# Altium schematic sheet 03-ADC.schdoc
size 307 x 218 mm; Symbol: muban; Device: muban; @Project Name: 12345678; @Create Date: 2025-07-10; @Schematic Name: Mini Oscilloscope; @Page Count: 5; @Update Date: 2025-07-12; @Update Time: 08:23:10; @Page Name: 03-ADC; @Page No: 3; @Create Time: 07:23:56; @Board Name: Base Board; Title Block Position: 3; Width: 1170; Height: 825; Region Start: 1; X Region Count: 6; Y Region Count: 4; Blade Width: 10; Description: 模拟题模板
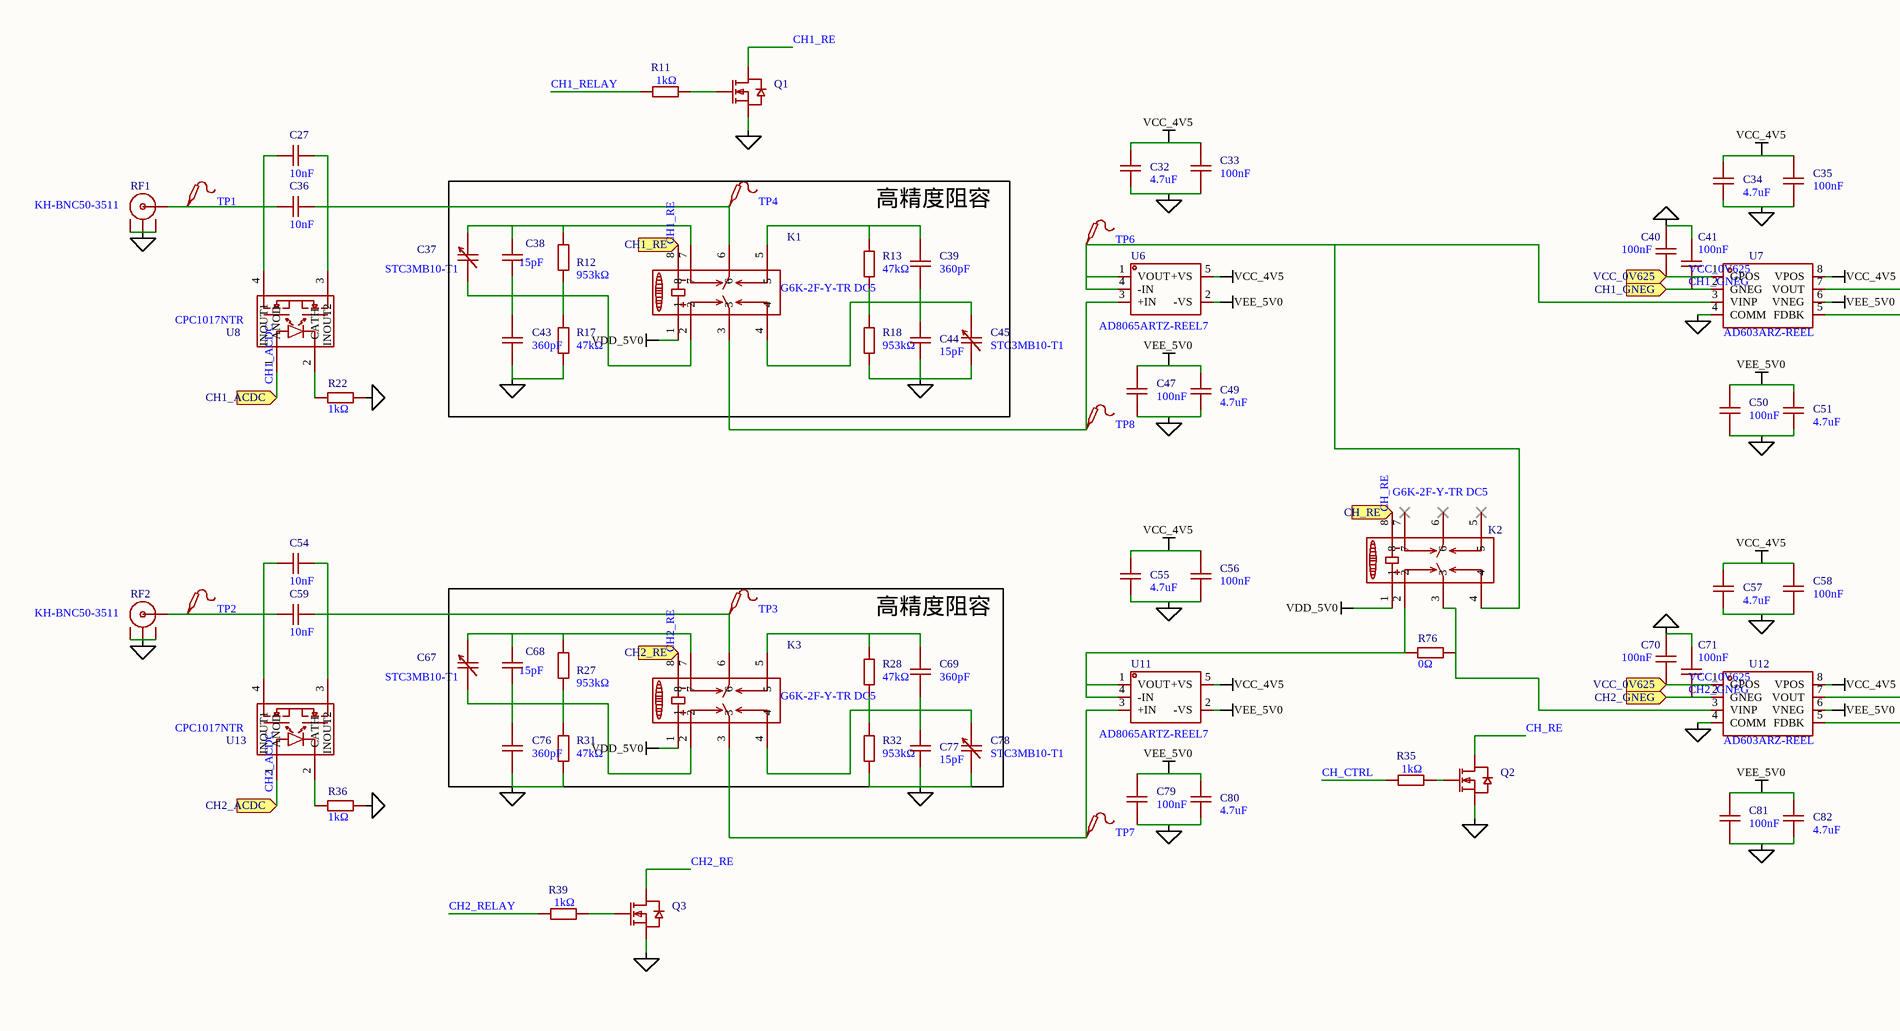
[diagram p0: 03-ADC.schdoc, left]
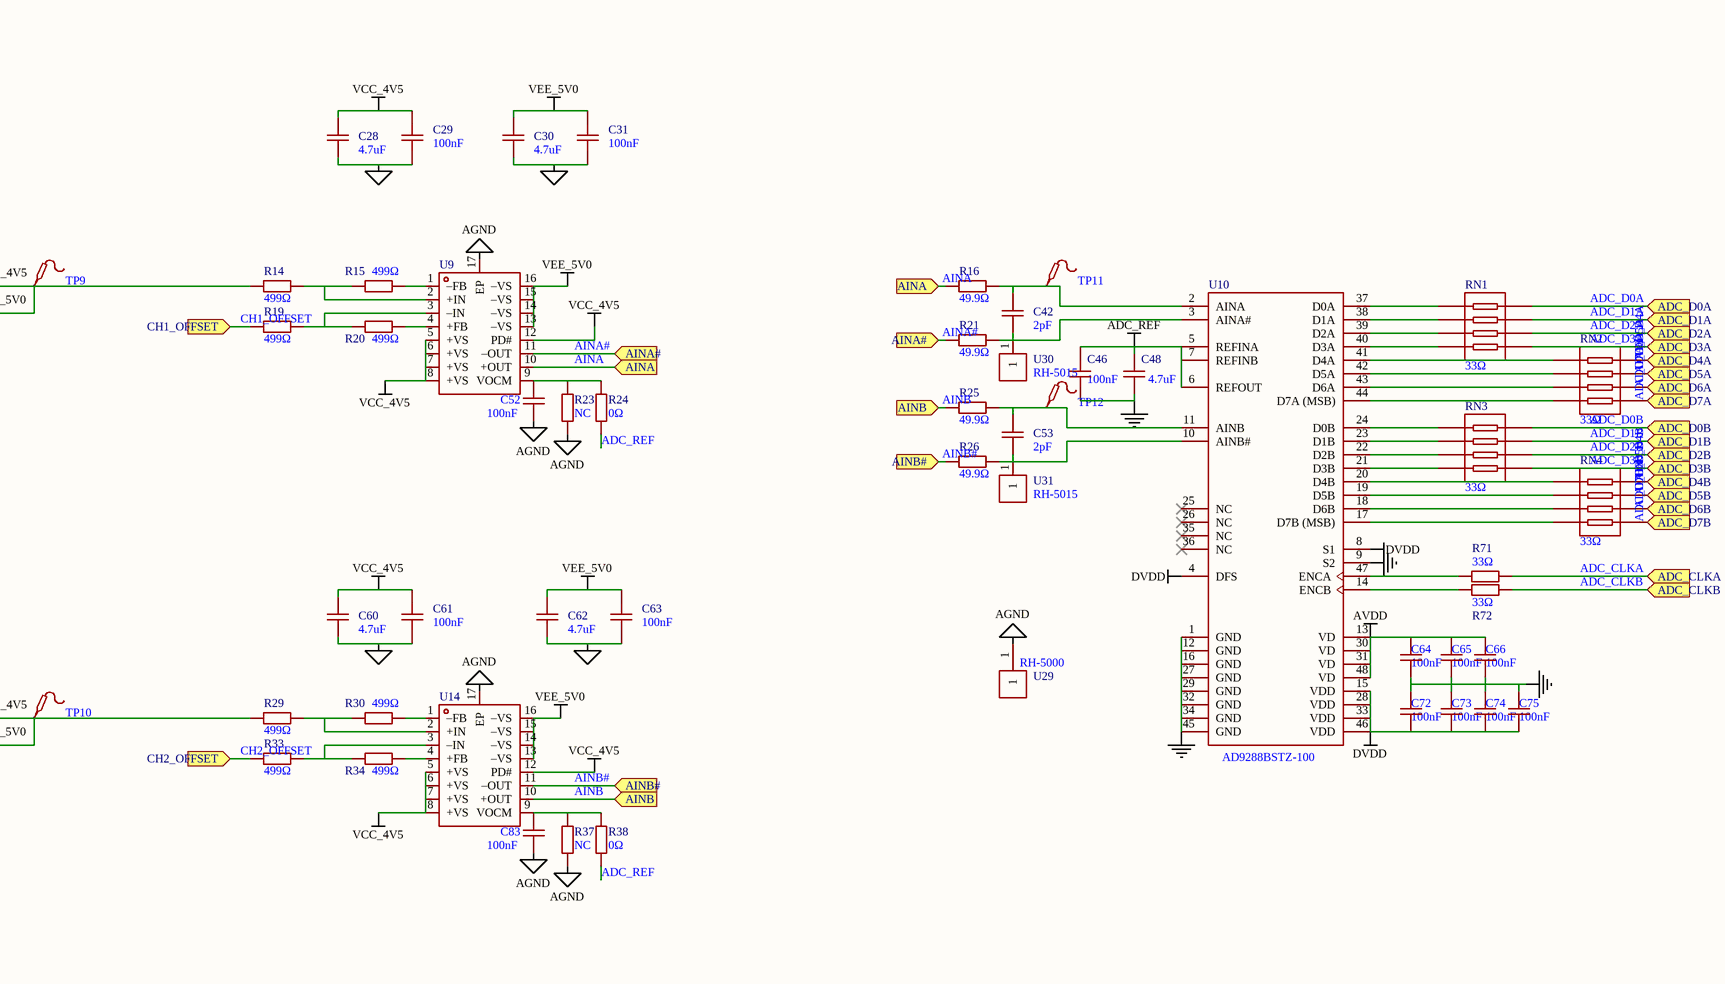
[diagram p1: 03-ADC.schdoc, right]

## Parts
C27  10nF  [C0603]
C28  4.7uF  [C0603]
C29  100nF  [C0603]
C30  4.7uF  [C0603]
C31  100nF  [C0603]
C32  4.7uF  [C0603]
C33  100nF  [C0603]
C34  4.7uF  [C0603]
C35  100nF  [C0603]
C36  10nF  [C0603]
C37  STC3MB10-T1  [CAP-SMD_L4.5-W3.2_STC3MD20-T1]
C38  15pF  [C0603]
C39  360pF  [C0603]
C40  100nF  [C0603]
C41  100nF  [C0603]
C42  2pF  [C0603]
C43  360pF  [C0603]
C44  15pF  [C0603]
C45  STC3MB10-T1  [CAP-SMD_L4.5-W3.2_STC3MD20-T1]
C46  100nF  [C0603]
C47  100nF  [C0603]
C48  4.7uF  [C0603]
C49  4.7uF  [C0603]
C50  100nF  [C0603]
C51  4.7uF  [C0603]
C52  100nF  [C0603]
C53  2pF  [C0603]
C54  10nF  [C0603]
C55  4.7uF  [C0603]
C56  100nF  [C0603]
C57  4.7uF  [C0603]
C58  100nF  [C0603]
C59  10nF  [C0603]
C60  4.7uF  [C0603]
C61  100nF  [C0603]
C62  4.7uF  [C0603]
C63  100nF  [C0603]
C64  100nF  [C0603]
C65  100nF  [C0603]
C66  100nF  [C0603]
C67  STC3MB10-T1  [CAP-SMD_L4.5-W3.2_STC3MD20-T1]
C68  15pF  [C0603]
C69  360pF  [C0603]
C70  100nF  [C0603]
C71  100nF  [C0603]
C72  100nF  [C0603]
C73  100nF  [C0603]
C74  100nF  [C0603]
C75  100nF  [C0603]
C76  360pF  [C0603]
C77  15pF  [C0603]
C78  STC3MB10-T1  [CAP-SMD_L4.5-W3.2_STC3MD20-T1]
C79  100nF  [C0603]
C80  4.7uF  [C0603]
C81  100nF  [C0603]
C82  4.7uF  [C0603]
C83  100nF  [C0603]
K1  G6K-2F-Y-TR DC5  [RELAY-SMD_G6K-2F-X-XX]
K2  G6K-2F-Y-TR DC5  [RELAY-SMD_G6K-2F-X-XX]
K3  G6K-2F-Y-TR DC5  [RELAY-SMD_G6K-2F-X-XX]
Q1  (no value)  [sot-23-3_l2.9-w1.3-p1.90-ls2.4-br]
Q2  (no value)  [sot-23-3_l2.9-w1.3-p1.90-ls2.4-br]
Q3  (no value)  [sot-23-3_l2.9-w1.3-p1.90-ls2.4-br]
R11  1kΩ  [R0603]
R12  953kΩ  [R0603]
R13  47kΩ  [R0603]
R14  499Ω  [R0603]
R15  499Ω  [R0603]
R16  49.9Ω  [R0603]
R17  47kΩ  [R0603]
R18  953kΩ  [R0603]
R19  499Ω  [R0603]
R20  499Ω  [R0603]
R21  49.9Ω  [R0603]
R22  1kΩ  [R0603]
R23  NC  [R0603]
R24  0Ω  [R0603]
R25  49.9Ω  [R0603]
R26  49.9Ω  [R0603]
R27  953kΩ  [R0603]
R28  47kΩ  [R0603]
R29  499Ω  [R0603]
R30  499Ω  [R0603]
R31  47kΩ  [R0603]
R32  953kΩ  [R0603]
R33  499Ω  [R0603]
R34  499Ω  [R0603]
R35  1kΩ  [R0603]
R36  1kΩ  [R0603]
R37  NC  [R0603]
R38  0Ω  [R0603]
R39  1kΩ  [R0603]
R71  33Ω  [R0603]
R72  33Ω  [R0603]
R76  0Ω  [R0603]
RF1  KH-BNC50-3511  [ANT-TH_KH-BNC50-3511]
RF2  KH-BNC50-3511  [ANT-TH_KH-BNC50-3511]
RN1  33Ω  [RES-ARRAY-SMD_0603-8P-L3.2-W1.6-BL]
RN2  33Ω  [RES-ARRAY-SMD_0603-8P-L3.2-W1.6-BL]
RN3  33Ω  [RES-ARRAY-SMD_0603-8P-L3.2-W1.6-BL]
RN4  33Ω  [RES-ARRAY-SMD_0603-8P-L3.2-W1.6-BL]
TP1  (no value)  [Test-Point-0.5mm]
TP2  (no value)  [Test-Point-0.5mm]
TP3  (no value)  [Test-Point-0.5mm]
TP4  (no value)  [Test-Point-0.5mm]
TP6  (no value)  [Test-Point-0.5mm]
TP7  (no value)  [Test-Point-0.5mm]
TP8  (no value)  [Test-Point-0.5mm]
TP9  (no value)  [Test-Point-0.5mm]
TP10  (no value)  [Test-Point-0.5mm]
TP11  (no value)  [Test-Point-0.5mm]
TP12  (no value)  [Test-Point-0.5mm]
U6  AD8065ARTZ-REEL7  [SOT-23-5_L3.0-W1.7-P0.95-LS2.8-BL]
U7  AD603ARZ-REEL  [SOIC-8_L4.9-W3.9-P1.27-LS6.0-BL]
U8  CPC1017NTR  [SOP-4_L4.1-W3.8-P2.54-LS6.1-BL]
U9  ADA4932-1YCPZ-R7  [LFCSP-16_L3.0-W3.0-P0.50-TL-EP]  (value not drawn)
U10  AD9288BSTZ-100  [LQFP-48_L7.0-W7.0-P0.50-LS9.0-BL]
U11  AD8065ARTZ-REEL7  [SOT-23-5_L3.0-W1.7-P0.95-LS2.8-BL]
U12  AD603ARZ-REEL  [SOIC-8_L4.9-W3.9-P1.27-LS6.0-BL]
U13  CPC1017NTR  [SOP-4_L4.1-W3.8-P2.54-LS6.1-BL]
U14  ADA4932-1YCPZ-R7  [LFCSP-16_L3.0-W3.0-P0.50-TL-EP]  (value not drawn)
U29  RH-5000  [TEST-TH_BD2.54-P1.4_RED]
U30  RH-5015  [SMD_RH-5015]
U31  RH-5015  [SMD_RH-5015]

## Blocks framed on the sheet
高精度阻容: C37-C39 C43-C45 K1 R12 R13 R17 R18 TP4
高精度阻容: C67-C69 C76-C78 K3 R27 R28 R31 R32 TP3

## Ports
ADC_CLKA (in), ADC_CLKB (in), ADC_D0A (in), ADC_D0B (in), ADC_D1A (in), ADC_D1B (in), ADC_D2A (in), ADC_D2B (in), ADC_D3A (in), ADC_D3B (in), ADC_D4A (in), ADC_D4B (in), ADC_D5A (in), ADC_D5B (in), ADC_D6A (in), ADC_D6B (in), ADC_D7A (in), ADC_D7B (in), AINA (in), AINA# (in), AINB (in), AINB# (in), CH1_ACDC (in), CH1_GNEG (in), CH1_OFFSET (in), CH1_RE (in), CH2_ACDC (in), CH2_GNEG (in), CH2_OFFSET (in), CH2_RE (in), CH_RE (in), VCC_0V625 (in)

## Nets
ADC_REF: C46.2 C48.2 R24.1 R38.1 U10.5(REFINA) U10.6(REFOUT) U10.7(REFINB)
AGND: C28.1 C29.1 C30.1 C31.1 C32.1 C33.1 C34.1 C35.1 C40.1 C41.2 C43.1 C44.2 C45.1 C47.1 C49.1 C50.1 C51.1 C52.1 C55.1 C56.1 C57.1 C58.1 C60.1 C61.1 C62.1 C63.1 C70.1 C71.2 C76.1 C77.2 C78.1 C79.1 C80.1 C81.1 C82.1 C83.1 Q1.2(S) Q2.2(S) Q3.2(S) R17.1 R18.2 R22.1 R23.1 R31.1 R32.2 R36.1 R37.1 RF1.2 RF1.3 RF1.4 RF2.2 RF2.3 RF2.4 U7.4(COMM) U9.17(EP) U12.4(COMM) U14.17(EP) U29.1
AVDD: C64.1 C65.1 C66.1 U10.13(VD) U10.30(VD) U10.31(VD) U10.48(VD)
DVDD: C72.2 C73.2 C74.2 C75.2 U10.4(DFS) U10.8(S1) U10.15(VDD) U10.28(VDD) U10.33(VDD) U10.46(VDD)
GND: C46.1 C48.1 C64.2 C65.2 C66.2 C72.1 C73.1 C74.1 C75.1 U10.1(GND) U10.9(S2) U10.12(GND) U10.16(GND) U10.27(GND) U10.29(GND) U10.32(GND) U10.34(GND) U10.45(GND)
VCC_4V5: C28.2 C29.2 C32.2 C33.2 C34.2 C35.2 C55.2 C56.2 C57.2 C58.2 C60.2 C61.2 U6.5(+VS) U7.8(VPOS) U9.5(+VS) U9.6(+VS) U9.7(+VS) U9.8(+VS) U9.12(PD#) U11.5(+VS) U12.8(VPOS) U14.5(+VS) U14.6(+VS) U14.7(+VS) U14.8(+VS) U14.12(PD#)
VDD_5V0: K1.1 K2.1 K3.1
VEE_5V0: C30.2 C31.2 C47.2 C49.2 C50.2 C51.2 C62.2 C63.2 C79.2 C80.2 C81.2 C82.2 U6.2(-VS) U7.6(VNEG) U9.13(–VS) U9.14(–VS) U9.15(–VS) U9.16(–VS) U11.2(-VS) U12.6(VNEG) U14.13(–VS) U14.14(–VS) U14.15(–VS) U14.16(–VS)
ADC_CLKA: R71.2 ; port ADC_CLKA
ADC_CLKB: R72.2 ; port ADC_CLKB
ADC_D0A: RN1.8 ; port ADC_D0A
ADC_D0B: RN3.8 ; port ADC_D0B
ADC_D1A: RN1.7 ; port ADC_D1A
ADC_D1B: RN3.7 ; port ADC_D1B
ADC_D2A: RN1.6 ; port ADC_D2A
ADC_D2B: RN3.6 ; port ADC_D2B
ADC_D3A: RN1.5 ; port ADC_D3A
ADC_D3B: RN3.5 ; port ADC_D3B
ADC_D4A: RN2.8 ; port ADC_D4A
ADC_D4B: RN4.8 ; port ADC_D4B
ADC_D5A: RN2.7 ; port ADC_D5A
ADC_D5B: RN4.7 ; port ADC_D5B
ADC_D6A: RN2.6 ; port ADC_D6A
ADC_D6B: RN4.6 ; port ADC_D6B
ADC_D7A: RN2.5 ; port ADC_D7A
ADC_D7B: RN4.5 ; port ADC_D7B
AINA: R16.1 U9.10(+OUT) ; port AINA
AINA#: R21.1 U9.11(–OUT) ; port AINA#
AINB: R25.1 U14.10(+OUT) ; port AINB
AINB#: R26.1 U14.11(–OUT) ; port AINB#
CH1_ACDC: U8.1(ANOD) ; port CH1_ACDC
CH1_GNEG: C41.1 U7.2(GNEG) ; port CH1_GNEG
CH1_OFFSET: R19.1 ; port CH1_OFFSET
CH1_RE: K1.8 Q1.3(D) ; port CH1_RE
CH1_RELAY: R11.2
CH2_ACDC: U13.1(ANOD) ; port CH2_ACDC
CH2_GNEG: C71.1 U12.2(GNEG) ; port CH2_GNEG
CH2_OFFSET: R33.1 ; port CH2_OFFSET
CH2_RE: K3.8 Q3.3(D) ; port CH2_RE
CH2_RELAY: R39.2
CH_CTRL: R35.2
CH_RE: K2.8 Q2.3(D) ; port CH_RE
VCC_0V625: C40.2 C70.2 U7.1(GPOS) U12.1(GPOS) ; port VCC_0V625
NetC27_1: C27.1 C36.1 RF1.1(OUT) TP1.1 U8.4(INOUT1)
NetC27_2: C27.2 C36.2 K1.6 TP4.1 U8.3(INOUT2)
NetC37_1: C37.1 C38.1 C43.2 K1.2 R12.1 R17.2
NetC37_2: C37.2 C38.2 K1.7 R12.2
NetC39_1: C39.1 K1.5 R13.1
NetC39_2: C39.2 C44.1 C45.2 K1.4 R13.2 R18.1
NetC42_1: C42.1 R21.2 U10.3(AINA#) U30.1
NetC42_2: C42.2 R16.2 TP11.1 U10.2(AINA)
NetC52_2: C52.2 R23.2 R24.2 U9.9(VOCM)
NetC53_1: C53.1 R26.2 U10.10(AINB#) U31.1
NetC53_2: C53.2 R25.2 TP12.1 U10.11(AINB)
NetC54_1: C54.1 C59.1 RF2.1(OUT) TP2.1 U13.4(INOUT1)
NetC54_2: C54.2 C59.2 K3.6 TP3.1 U13.3(INOUT2)
NetC67_1: C67.1 C68.1 C76.2 K3.2 R27.1 R31.2
NetC67_2: C67.2 C68.2 K3.7 R27.2
NetC69_1: C69.1 K3.5 R28.1
NetC69_2: C69.2 C77.1 C78.2 K3.4 R28.2 R32.1
NetC83_2: C83.2 R37.2 R38.2 U14.9(VOCM)
NetK1_3: K1.3 TP8.1 U6.3(+IN)
NetK2_2: K2.2 R76.1 U11.1(VOUT) U11.4(-IN)
NetK2_3: K2.3 R76.2 U12.3(VINP)
NetK2_4: K2.4 TP6.1 U6.1(VOUT) U6.4(-IN) U7.3(VINP)
NetK3_3: K3.3 TP7.1 U11.3(+IN)
NetQ1_1: Q1.1(G) R11.1
NetQ2_1: Q2.1(G) R35.1
NetQ3_1: Q3.1(G) R39.1
NetR14_1: R14.1 TP9.1 U7.5(FDBK) U7.7(VOUT)
NetR14_2: R14.2 R15.1 U9.2(+IN)
NetR15_2: R15.2 U9.1(–FB)
NetR19_2: R19.2 R20.1 U9.3(–IN)
NetR20_2: R20.2 U9.4(+FB)
NetR22_2: R22.2 U8.2(CATH)
NetR29_1: R29.1 TP10.1 U12.5(FDBK) U12.7(VOUT)
NetR29_2: R29.2 R30.1 U14.2(+IN)
NetR30_2: R30.2 U14.1(–FB)
NetR33_2: R33.2 R34.1 U14.3(–IN)
NetR34_2: R34.2 U14.4(+FB)
NetR36_2: R36.2 U13.2(CATH)
NetR71_1: R71.1 U10.47(ENCA)
NetR72_1: R72.1 U10.14(ENCB)
NetRN1_1: RN1.1 U10.37(D0A)
NetRN1_2: RN1.2 U10.38(D1A)
NetRN1_3: RN1.3 U10.39(D2A)
NetRN1_4: RN1.4 U10.40(D3A)
NetRN2_1: RN2.1 U10.41(D4A)
NetRN2_2: RN2.2 U10.42(D5A)
NetRN2_3: RN2.3 U10.43(D6A)
NetRN2_4: RN2.4 U10.44(D7A_(MSB))
NetRN3_1: RN3.1 U10.24(D0B)
NetRN3_2: RN3.2 U10.23(D1B)
NetRN3_3: RN3.3 U10.22(D2B)
NetRN3_4: RN3.4 U10.21(D3B)
NetRN4_1: RN4.1 U10.20(D4B)
NetRN4_2: RN4.2 U10.19(D5B)
NetRN4_3: RN4.3 U10.18(D6B)
NetRN4_4: RN4.4 U10.17(D7B_(MSB))

Not connected (* = marked no-connect by the designer): K2 5* 6* 7*; U10 25(NC)* 26(NC)* 35(NC)* 36(NC)*

## Notes on the sheet
- 1
- 2
- 3
- 4
- 5
- 6
- A
- B
- C
- D

## Library data of the parts
C27 C36 C54 C59 = CC0603KRX7R9BB103: Manufacturer: YAGEO(国巨); Symbol: CC0603KRX7R0BB103; Add into BOM: yes; Tolerance: ±10%; Voltage Rated: 50V; Temperature Coefficient: X7R; Device: CC0603KRX7R9BB103; LCSC Part Name: 10nF ±10% 50V; Supplier Part: C100042; Manufacturer Part: CC0603KRX7R9BB103; Supplier Footprint: 0603; JLCPCB Part Class: Extended Part; Datasheet: https://atta.szlcsc.com/upload/public/pdf/source/20181008/C309510_22F155564471FAF6A489F7D68F34234E.pdf; Supplier: LCSC; Convert to PCB: yes; Value: 10nF
C28 C30 C32 C34 C48 C49 C51 C55 C57 C60 C62 C80 C82 = CL10A475KO8NNNC: Manufacturer: SAMSUNG(三星); Add into BOM: yes; Tolerance: ±10%; Voltage Rated: 16V; Temperature Coefficient: X5R; Symbol: CL10A475KO8NNNC; Device: CL10A475KO8NNNC; LCSC Part Name: 4.7uF ±10% 16V; Supplier Part: C19666; Manufacturer Part: CL10A475KO8NNNC; Supplier Footprint: 0603; JLCPCB Part Class: Basic Part; Datasheet: https://atta.szlcsc.com/upload/public/pdf/source/20160218/1457707763339.pdf; Supplier: LCSC; Convert to PCB: yes; Value: 4.7uF
C29 C31 C33 C35 C40 C41 C46 C47 C50 C56 C58 C61 C63 C70 C71 C79 C81 = CGA0603X7R104K500JT: Manufacturer: HRE(芯声); Symbol: CC0603KRX7R9BB104; Add into BOM: yes; Tolerance: ±10%; Voltage Rated: 50V; Temperature Coefficient: X7R; Device: CGA0603X7R104K500JT; LCSC Part Name: 100nF ±10% 50V; Supplier Part: C6119867; Manufacturer Part: CGA0603X7R104K500JT; Supplier Footprint: 0603; JLCPCB Part Class: Extended Part; Datasheet: https://atta.szlcsc.com/upload/public/pdf/source/20250103/C44077DA9E7B3EFAE02F22B6D3D1CBC9.pdf; Supplier: LCSC; Convert to PCB: yes; Value: 100nF; Voltage Rating: 50V
C37 C45 C67 C78 = STC3MB10-T1: Manufacturer: SEHWA(韩国世华); Add into BOM: yes; electrostatic capacity: 3pF~10pF; Tolerance: 0%~+50%; Rated Voltage: 100V; Q @ Freq: 600@1MHz; Body Length: 4.5mm; Body Width: 3.2mm; Body Height: 1.5mm; Symbol: STC3MB10-T1; Device: STC3MB10-T1; LCSC Part Name: 3pF~10pF 100V; Supplier Part: C22468121; Manufacturer Part: STC3MB10-T1; Supplier Footprint: SMD,4.5x3.2mm; JLCPCB Part Class: 扩展库; Datasheet: https://atta.szlcsc.com/upload/public/pdf/source/20240625/3635C187CDEBB153FE63594366C5F0CE.pdf; Supplier: LCSC; Convert to PCB: yes; Operating Temperature: -25℃~+85℃
C38 C44 C68 C77 = CL10C150JB8NNNC: Manufacturer: SAMSUNG(三星); Add into BOM: yes; Tolerance: ±5%; Voltage Rated: 50V; Temperature Coefficient: C0G; Symbol: CL10C150JB8NNNC; Device: CL10C150JB8NNNC; LCSC Part Name: 15pF ±5% 50V; Supplier Part: C1644; Manufacturer Part: CL10C150JB8NNNC; Supplier Footprint: 0603; JLCPCB Part Class: Basic Part; Datasheet: https://atta.szlcsc.com/upload/public/pdf/source/20160218/1457707763339.pdf; Supplier: LCSC; Convert to PCB: yes; Value: 15pF
C39 C43 C69 C76 = CC0603JRNPO9BN361: Manufacturer: YAGEO(国巨); Add into BOM: yes; Tolerance: ±5%; Voltage Rated: 50V; Temperature Coefficient: NP0; Symbol: CC0603JRNPO9BN361; Device: CC0603JRNPO9BN361; LCSC Part Name: 360pF ±5% 50V; Supplier Part: C513587; Manufacturer Part: CC0603JRNPO9BN361; Supplier Footprint: 0603; JLCPCB Part Class: 扩展库; Datasheet: https://atta.szlcsc.com/upload/public/pdf/source/20200720/C513587_5034A81EC915B34B5783BA1E5C90B9FE.pdf; Supplier: LCSC; Convert to PCB: yes; Value: 360pF
C42 C53 = 0603CG2R0C500NT: Manufacturer: FH(风华); Add into BOM: yes; Voltage Rated: 50V; Temperature Coefficient: C0G; Symbol: 0603CG2R0C500NT; Device: 0603CG2R0C500NT; LCSC Part Name: 2pF 50V; Supplier Part: C1650; Manufacturer Part: 0603CG2R0C500NT; Supplier Footprint: 0603; JLCPCB Part Class: 扩展库; Datasheet: https://atta.szlcsc.com/upload/public/pdf/source/20200305/C486355_26A10D38EF8C2A5C37091D0039909270.pdf; Supplier: LCSC; Convert to PCB: yes; Value: 2pF
C52 C64-C66 C72-C75 C83 = CGA0603X7R104K500JT: Manufacturer: HRE(芯声); Symbol: GCM155R71C104KA40D; Add into BOM: yes; Tolerance: ±10%; Voltage Rated: 50V; Temperature Coefficient: X7R; Device: CGA0603X7R104K500JT; LCSC Part Name: 100nF ±10% 50V; Supplier Part: C6119867; Manufacturer Part: CGA0603X7R104K500JT; Supplier Footprint: 0603; JLCPCB Part Class: Extended Part; Datasheet: https://atta.szlcsc.com/upload/public/pdf/source/20250103/C44077DA9E7B3EFAE02F22B6D3D1CBC9.pdf; Supplier: LCSC; Convert to PCB: yes; Value: 100nF; Voltage Rating: 50V
K1-K3 = G6K-2F-Y-TR DC5: Manufacturer: OMRON(欧姆龙); Symbol: G6K-2F-Y-DC5; Add into BOM: yes; Coil Voltage: 5V; Contact Form: 两组转换:2C(双刀双掷-转换); Maximum Switching Voltage: 125V@AC；60V@DC; Maximum Switching Current: 1A; Operate Time: 3ms; Device: G6K-2F-Y-TR DC5; LCSC Part Name: G6K-2F-Y-TR DC5; Supplier Part: C47190; Manufacturer Part: G6K-2F-Y-TR DC5; Supplier Footprint: SMD,6.5x10mm; JLCPCB Part Class: 扩展库; Datasheet: https://atta.szlcsc.com/upload/public/pdf/source/20220125/C1876770_53E5491D4B68F29C4BBD8118E9BAE0E8.pdf; Supplier: LCSC; Convert to PCB: yes; Pin Number: -; Contact Rating: -; Contact Material: 银+镀金; Coil Resistance: -; Release Time: 3ms; Coil Type: -; Contact Resistance: -; Operating Temperature: -40℃~+70℃
Q1-Q3 = BSS138_C518792: Manufacturer: HUASHUO(华朔); Manufacturer Part: BSS138; Add into BOM: yes; Type: N沟道; Drain Source Voltage (Vdss): 50V; Continuous Drain Current (Id): 230mA; Power Dissipation (Pd): 230mW; Drain Source On Resistance (RDS(on)@Vgs,Id): 3.4@10V,220mA; Gate Threshold Voltage (Vgs(th)@Id): 1.5V@250A; Symbol: BSS138_C518792; Device: BSS138_C518792; LCSC Part Name: N沟道 50V 230mA; Supplier Part: C518792; LCSC Stock: 978; LCSC On Sale: 1; Supplier Footprint: SOT-23-3; Price: 0.175; JLCPCB Part Class: Extended Part; JLCPCB Stock: 14; JLCPCB On Sale: 1; Datasheet: https://atta.szlcsc.com/upload/public/pdf/source/20200421/C518792_D85FA0B62FA706121A083A947539CC79.pdf; Supplier: LCSC; Convert to PCB: yes
R11 R35 R39 = 0603WAF1001T5E: Manufacturer: UNI-ROYAL(厚声); Symbol: rs-03k621ft; Add into BOM: yes; Tolerance: ±1%; Power(Watts): 100mW; Overload Voltage (Max): 75V; Temperature Coefficient: ±100ppm/℃; Device: 0603WAF1001T5E; LCSC Part Name: 1kΩ ±1% 100mW 厚膜电阻; Supplier Part: C21190; Manufacturer Part: 0603WAF1001T5E; Supplier Footprint: 0603; JLCPCB Part Class: Basic Part; Datasheet: https://atta.szlcsc.com/upload/public/pdf/source/20200306/C422600_1E6D84923E4A46A82E41ADD87F860B5C.pdf; Supplier: LCSC; Convert to PCB: yes; Type: 厚膜电阻; Value: 1kΩ; Operating Temperature Range: -55℃~+155℃
R12 R18 R27 R32 = 0603WAF9533T5E: Manufacturer: UNI-ROYAL(厚声); Add into BOM: yes; Tolerance: ±1%; Power(Watts): 100mW; Overload Voltage (Max): 75V; Temperature Coefficient: ±100ppm/℃; Symbol: 0603WAF9533T5E; Device: 0603WAF9533T5E; LCSC Part Name: 953kΩ ±1% 100mW 厚膜电阻; Supplier Part: C246846; Manufacturer Part: 0603WAF9533T5E; Supplier Footprint: 0603; JLCPCB Part Class: 扩展库; Datasheet: https://atta.szlcsc.com/upload/public/pdf/source/20200306/C422600_1E6D84923E4A46A82E41ADD87F860B5C.pdf; Supplier: LCSC; Convert to PCB: yes; Type: 厚膜电阻; Value: 953kΩ; Operating Temperature Range: -55℃~+155℃
R13 R17 R28 R31 = 0603WAF4702T5E: Manufacturer: UNI-ROYAL(厚声); Add into BOM: yes; Tolerance: ±1%; Power(Watts): 100mW; Overload Voltage (Max): 75V; Temperature Coefficient: ±100ppm/℃; Symbol: 0603WAF4702T5E; Device: 0603WAF4702T5E; LCSC Part Name: 47kΩ ±1% 100mW 厚膜电阻; Supplier Part: C25819; Manufacturer Part: 0603WAF4702T5E; Supplier Footprint: 0603; JLCPCB Part Class: Basic Part; Datasheet: https://atta.szlcsc.com/upload/public/pdf/source/20200306/C422600_1E6D84923E4A46A82E41ADD87F860B5C.pdf; Supplier: LCSC; Convert to PCB: yes; Type: 厚膜电阻; Value: 47kΩ; Operating Temperature Range: -55℃~+155℃
R14 R15 R19 R20 R29 R30 R33 R34 = 0603WAF4990T5E: Manufacturer: UNI-ROYAL(厚声); Add into BOM: yes; Tolerance: ±1%; Power(Watts): 100mW; Overload Voltage (Max): 75V; Temperature Coefficient: ±100ppm/℃; Symbol: 0603WAF4990T5E; Device: 0603WAF4990T5E; LCSC Part Name: 499Ω ±1% 100mW 厚膜电阻; Supplier Part: C23065; Manufacturer Part: 0603WAF4990T5E; Supplier Footprint: 0603; JLCPCB Part Class: 扩展库; Datasheet: https://atta.szlcsc.com/upload/public/pdf/source/20200306/C422600_1E6D84923E4A46A82E41ADD87F860B5C.pdf; Supplier: LCSC; Convert to PCB: yes; Type: 厚膜电阻; Value: 499Ω; Operating Temperature Range: -55℃~+155℃
R16 R21 R25 R26 = 0603WAF499JT5E: Manufacturer: UNI-ROYAL(厚声); Add into BOM: yes; Tolerance: ±1%; Power(Watts): 100mW; Overload Voltage (Max): 75V; Temperature Coefficient: ±100ppm/℃; Symbol: 0603WAF499JT5E; Device: 0603WAF499JT5E; LCSC Part Name: 49.9Ω ±1% 100mW 厚膜电阻; Supplier Part: C23185; Manufacturer Part: 0603WAF499JT5E; Supplier Footprint: 0603; JLCPCB Part Class: 基础库; Datasheet: https://atta.szlcsc.com/upload/public/pdf/source/20200306/C422600_1E6D84923E4A46A82E41ADD87F860B5C.pdf; Supplier: LCSC; Convert to PCB: yes; Type: 厚膜电阻; Value: 49.9Ω; Operating Temperature Range: -55℃~+155℃
R22 R36 = 0603WAF1001T5E: Manufacturer: UNI-ROYAL(厚声); Add into BOM: yes; Tolerance: ±1%; Power(Watts): 100mW; Overload Voltage (Max): 75V; Temperature Coefficient: ±100ppm/℃; Symbol: 0603WAF1001T5E; Device: 0603WAF1001T5E; LCSC Part Name: 1kΩ ±1% 100mW 厚膜电阻; Supplier Part: C21190; Manufacturer Part: 0603WAF1001T5E; Supplier Footprint: 0603; JLCPCB Part Class: Basic Part; Datasheet: https://atta.szlcsc.com/upload/public/pdf/source/20200306/C422600_1E6D84923E4A46A82E41ADD87F860B5C.pdf; Supplier: LCSC; Convert to PCB: yes; Type: 厚膜电阻; Value: 1kΩ; Operating Temperature Range: -55℃~+155℃
R23 R24 R37 R38 R76 = 0603WAF0000T5E: Manufacturer: UNI-ROYAL(厚声); Add into BOM: yes; Tolerance: ±1%; Power(Watts): 100mW; Overload Voltage (Max): 75V; Symbol: 0603WAF0000T5E; Device: 0603WAF0000T5E; Supplier: LCSC; Manufacturer Part: 0603WAF0000T5E; JLCPCB Part Class: 基础库; LCSC Part Name: 0Ω ±1% 100mW; Supplier Footprint: 0603; Datasheet: https://atta.szlcsc.com/upload/public/pdf/source/20200306/C422600_1E6D84923E4A46A82E41ADD87F860B5C.pdf; Convert to PCB: yes; Type: 厚膜电阻; Operating Temperature Range: -55℃~+155℃
  R23 R37: Value: NC
  R24 R38 R76: Supplier Part: C21189; Value: 0Ω
R71 R72 = 0603WAF330JT5E: Manufacturer: UNI-ROYAL(厚声); Add into BOM: yes; Tolerance: ±1%; Power(Watts): 100mW; Overload Voltage (Max): 75V; Temperature Coefficient: ±100ppm/℃; Symbol: 0603WAF330JT5E; Device: 0603WAF330JT5E; LCSC Part Name: 33Ω ±1% 100mW 厚膜电阻; Supplier Part: C23140; Manufacturer Part: 0603WAF330JT5E; Supplier Footprint: 0603; JLCPCB Part Class: Basic Part; Datasheet: https://atta.szlcsc.com/upload/public/pdf/source/20200306/C422600_1E6D84923E4A46A82E41ADD87F860B5C.pdf; Supplier: LCSC; Convert to PCB: yes; Type: 厚膜电阻; Value: 33Ω; Operating Temperature Range: -55℃~+155℃
RF1 RF2 = KH-BNC50-3511: Manufacturer: kinghelm(金航标); Add into BOM: yes; Connector Type: 板端; Interface Type: 内孔; Number of Ports: 1; Interface Diameter: 9.5mm; Frequency-Max: 3GHz; RF Series: BNC; Impedance: 50Ω; Style: 弯头; Symbol: KH-BNC50-3511; Device: KH-BNC50-3511; LCSC Part Name: BNC 内孔 弯头; Supplier Part: C2837587; Manufacturer Part: KH-BNC50-3511; Supplier Footprint: 插件; JLCPCB Part Class: 扩展库; Datasheet: https://atta.szlcsc.com/upload/public/pdf/source/20221123/AFF24A942BB0EF6B7776F494013BE75C.pdf; Supplier: LCSC; Convert to PCB: yes; Interface Length/Height: -; Operating Temperature Range: -55℃~+155℃
RN1-RN4 = 4D03WGJ0330T5E: Manufacturer: UNI-ROYAL(厚声); Add into BOM: yes; Number of Resistors: 4; Tolerance: ±5%; Power(Watts): 62.5mW; Temperature Coefficient: ±200ppm/℃; Symbol: 4D03WGJ0330T5E; Device: 4D03WGJ0330T5E; LCSC Part Name: 33Ω ±5%; Supplier Part: C25508; Manufacturer Part: 4D03WGJ0330T5E; Supplier Footprint: 0603x4; JLCPCB Part Class: 扩展库; Datasheet: https://atta.szlcsc.com/upload/public/pdf/source/20191224/C474318_2527498AE30E813171187CCD28401A71.pdf; Supplier: LCSC; Convert to PCB: yes; Value: 33Ω; Number of Pins: 8
TP1-TP4 TP6-TP12 = Test-Point: Add into BOM: yes; Symbol: Test-Point; Device: Test-Point; Convert to PCB: yes
U6 U11 = AD8065ARTZ-REEL7: Manufacturer: ADI(亚德诺); Add into BOM: yes; Slew Rate(SR): 180V/us; Supply Current Per Channel: 6.6mA; Symbol: AD8065ARTZ-REEL7; Device: AD8065ARTZ-REEL7; LCSC Part Name: 高性能、145 MHz FastFET™运算放大器; Supplier Part: C9648; Manufacturer Part: AD8065ARTZ-REEL7; Supplier Footprint: SOT-23-5; JLCPCB Part Class: 扩展库; Datasheet: https://atta.szlcsc.com/upload/public/pdf/source/20190724/C406721_7F0014C6A9B930583CF1868CC468A0F9.pdf; Supplier: LCSC; Convert to PCB: yes; Operating Temperature: -40℃~+85℃
U7 U12 = AD603ARZ-REEL: Manufacturer: ADI(亚德诺); Add into BOM: yes; Symbol: AD603ARZ; Device: AD603ARZ-REEL; LCSC Part Name: 低噪声90MHz可变增益放大器; Supplier Part: C578331; Manufacturer Part: AD603ARZ-REEL; Supplier Footprint: SOIC-8; JLCPCB Part Class: 扩展库; Datasheet: https://atta.szlcsc.com/upload/public/pdf/source/20200225/C428870_2540098E542F69B8418644EFC7A80A81.pdf; Supplier: LCSC; Convert to PCB: yes
U8 U13 = CPC1017NTR: Manufacturer: Littelfuse/IXYS; Add into BOM: yes; Relay Contact Form: 1 Form A(SPST-NO); Load Type: AC,DC; Input Forward Voltage: 1.2V; Voltage - Load: 60V; Continuous Load Current: 100mA; On Resistance: 16Ω; Isolation Voltage(rms): 1.5kV; Turn-on time: 10ms; Symbol: CPC1017NTR; Device: CPC1017NTR; LCSC Part Name: 1 Form A(SPSTNO) 负载AC,DC 负载电压60V; Supplier Part: C81521; Manufacturer Part: CPC1017NTR; Supplier Footprint: SOP-4-2.54mm; JLCPCB Part Class: 扩展库; Datasheet: https://atta.szlcsc.com/upload/public/pdf/source/20170919/C81521_1505787400549977272.pdf; Supplier: LCSC; Convert to PCB: yes; Turn-off time: 10ms
U9 U14 = ADA4932-1YCPZ-R7: Manufacturer: ADI(亚德诺); Symbol: ADA4937-1YCPZ-RL; Add into BOM: yes; Device: ADA4932-1YCPZ-R7; LCSC Part Name: 高性能低功耗差分ADC驱动器; Supplier Part: C206666; Manufacturer Part: ADA4932-1YCPZ-R7; Supplier Footprint: LFCSP-16(3x3); JLCPCB Part Class: Extended Part; Datasheet: https://atta.szlcsc.com/upload/public/pdf/source/20200309/C494505_BB399B04ACF7E8080BF0845658E50F75.pdf; Supplier: LCSC; Convert to PCB: yes
U10 = AD9288BSTZ-100: Manufacturer: ADI(亚德诺); Add into BOM: yes; resolution: 8位; sampling frequency: 100MHz; number of channels: 2; Supply Voltage: 2.7V~3.6V; differential input: 是; Integral nonlinearity: 0.5LSB; Symbol: AD9288BSTZ-100; Device: AD9288BSTZ-100; LCSC Part Name: 8位，40/80/100 MSPS 双通道A/D转换器; Supplier Part: C31151; Manufacturer Part: AD9288BSTZ-100; Supplier Footprint: LQFP-48(7x7); JLCPCB Part Class: 扩展库; Datasheet: https://atta.szlcsc.com/upload/public/pdf/source/20140508/1457707057464.pdf; Supplier: LCSC; Convert to PCB: yes; Interface: -; Operating Temperature: -40℃~+85℃
U29 = RH-5000: Manufacturer: 荣和; Add into BOM: yes; Symbol: RH-5000; Device: RH-5000; LCSC Part Name: PCB电路板测试点/测试针; Supplier Part: C5277086; Manufacturer Part: RH-5000; Supplier Footprint: -; JLCPCB Part Class: 扩展库; Datasheet: https://atta.szlcsc.com/upload/public/pdf/source/20230704/1671C2774A3D6CEDC1FD6AAF48538C87.pdf; Supplier: LCSC; Convert to PCB: yes
U30 U31 = RH-5015: Manufacturer: 荣和; Add into BOM: yes; Connector Type: 铁环型(贴片); Plastic Color: 无塑胶; Board Space (Diameter φ/ Length x Width): 2.67mmx1.02mm; Symbol: RH-5015; Device: RH-5015; LCSC Part Name: PCB电路板测试点/测试针; Supplier Part: C5199798; Manufacturer Part: RH-5015; Supplier Footprint: -; JLCPCB Part Class: 扩展库; Datasheet: https://atta.szlcsc.com/upload/public/pdf/source/20231026/DF0E995FBD7BB891A195515CC364B170.pdf; Supplier: LCSC; Convert to PCB: yes